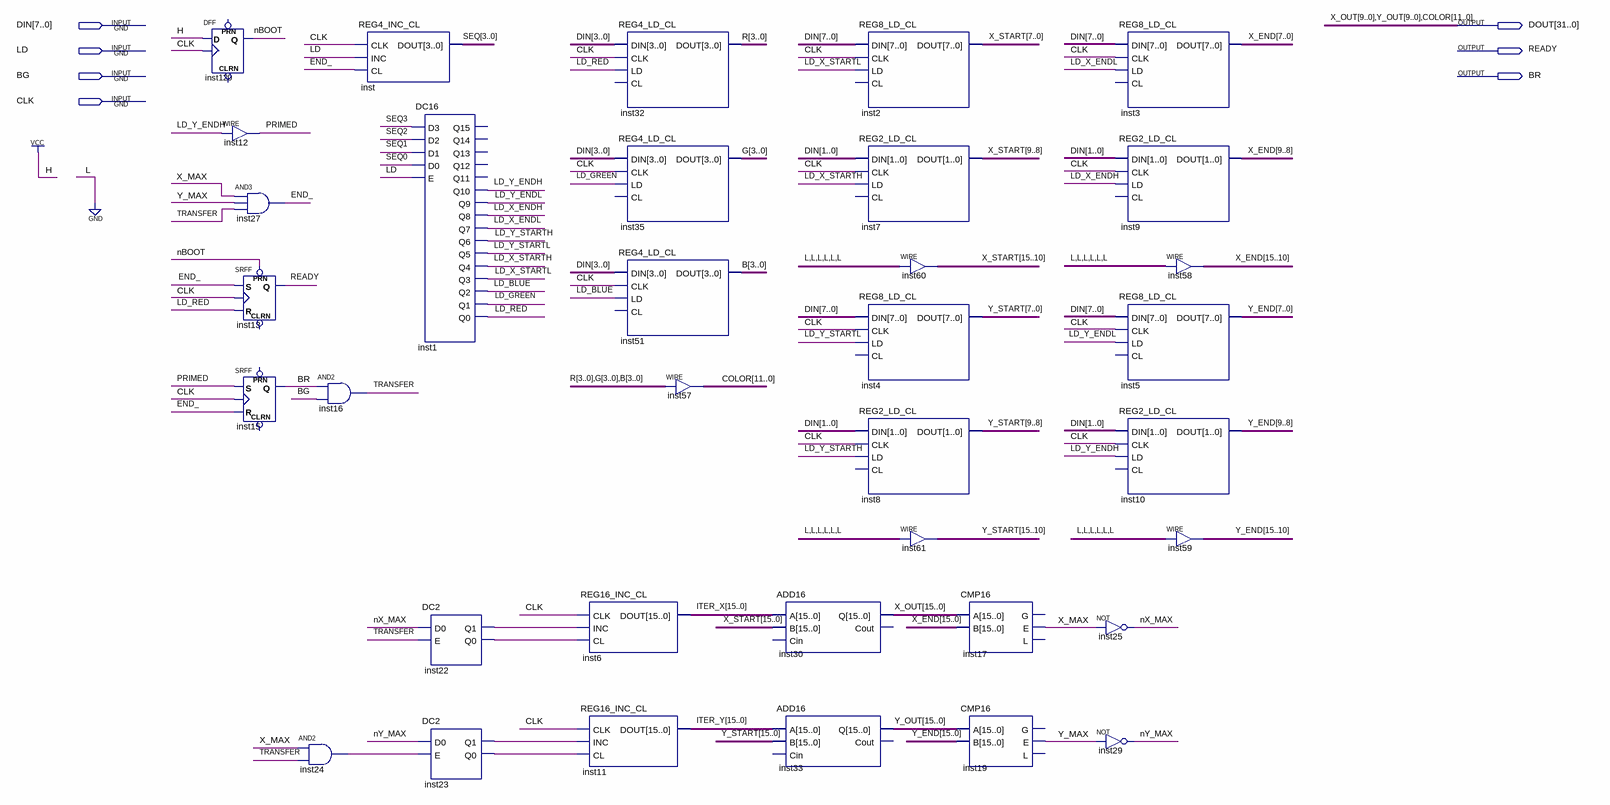
[diagram p0: schematic sheet]
// Quartus schematic render_rect.bdf as structural Verilog: 35 symbols, 7 pins
module render_rect (
  input  [7:0] DIN,
  input  LD,
  input  BG,
  input  CLK,
  output [31:0] DOUT,
  output READY,
  output BR
);

  wire END_, inst22_q0, inst22_q1, inst23_q0, inst23_q1, inst24_out, LD_BLUE, LD_GREEN, LD_RED, LD_X_ENDH,
       LD_X_ENDL, LD_X_STARTH, LD_X_STARTL, LD_Y_ENDH, LD_Y_ENDL, LD_Y_STARTH, LD_Y_STARTL, nBOOT, nX_MAX,
       nY_MAX, PRIMED, TRANSFER, X_MAX, Y_MAX;
  wire [3:0] B, G, R, SEQ;
  wire [15:0] ITER_X, ITER_Y, X_END, X_START, Y_END, Y_START;
  wire [15:10] X_OUT, Y_OUT;

  DFF inst120 (.CLK(CLK), .D(1'b1), .Q(nBOOT));  // open: CLRN, PRN
  assign PRIMED = LD_Y_ENDH;  // WIRE inst12
  and inst27 (END_, X_MAX, Y_MAX, TRANSFER);
  SRFF inst13 (.PRN(nBOOT), .S(END_), .R(LD_RED), .CLK(CLK), .Q(READY));  // open: CLRN
  SRFF inst15 (.S(PRIMED), .R(END_), .CLK(CLK), .Q(BR));  // open: PRN, CLRN
  and inst16 (TRANSFER, BR, BG);
  and inst24 (inst24_out, X_MAX, TRANSFER);
  REG4_INC_CL inst (.CLK(CLK), .INC(LD), .CL(END_), .DOUT(SEQ));
  DC16 inst1 (
    .D3(SEQ[3]), .D2(SEQ[2]), .D1(SEQ[1]), .D0(SEQ[0]), .E(LD), .Q10(LD_Y_ENDH), .Q9(LD_Y_ENDL),
    .Q8(LD_X_ENDH), .Q7(LD_X_ENDL), .Q6(LD_Y_STARTH), .Q5(LD_Y_STARTL), .Q4(LD_X_STARTH), .Q3(LD_X_STARTL),
    .Q2(LD_BLUE), .Q1(LD_GREEN), .Q0(LD_RED));  // open: Q15, Q14, Q13, Q12, Q11
  DC2 inst22 (.D0(nX_MAX), .E(TRANSFER), .Q1(inst22_q1), .Q0(inst22_q0));
  DC2 inst23 (.D0(nY_MAX), .E(inst24_out), .Q1(inst23_q1), .Q0(inst23_q0));
  REG16_INC_CL inst6 (.CLK(CLK), .INC(inst22_q1), .CL(inst22_q0), .DOUT(ITER_X));
  REG16_INC_CL inst11 (.CLK(CLK), .INC(inst23_q1), .CL(inst23_q0), .DOUT(ITER_Y));
  REG4_LD_CL inst32 (.DIN(DIN[3:0]), .CLK(CLK), .LD(LD_RED), .DOUT(R));  // open: CL
  REG4_LD_CL inst35 (.DIN(DIN[3:0]), .CLK(CLK), .LD(LD_GREEN), .DOUT(G));  // open: CL
  REG4_LD_CL inst51 (.DIN(DIN[3:0]), .CLK(CLK), .LD(LD_BLUE), .DOUT(B));  // open: CL
  assign DOUT[11:0] = {R, G, B};  // WIRE inst57
  ADD16 inst30 (.A(ITER_X), .B(X_START), .Q({X_OUT, DOUT[31:22]}));  // open: Cin, Cout
  ADD16 inst33 (.A(ITER_Y), .B(Y_START), .Q({Y_OUT, DOUT[21:12]}));  // open: Cin, Cout
  REG8_LD_CL inst2 (.DIN(DIN), .CLK(CLK), .LD(LD_X_STARTL), .DOUT(X_START[7:0]));  // open: CL
  REG2_LD_CL inst7 (.DIN(DIN[1:0]), .CLK(CLK), .LD(LD_X_STARTH), .DOUT(X_START[9:8]));  // open: CL
  assign X_START[15:10] = {6{1'b0}};  // WIRE inst60
  REG8_LD_CL inst4 (.DIN(DIN), .CLK(CLK), .LD(LD_Y_STARTL), .DOUT(Y_START[7:0]));  // open: CL
  REG2_LD_CL inst8 (.DIN(DIN[1:0]), .CLK(CLK), .LD(LD_Y_STARTH), .DOUT(Y_START[9:8]));  // open: CL
  assign Y_START[15:10] = {6{1'b0}};  // WIRE inst61
  CMP16 inst17 (.A({X_OUT, DOUT[31:22]}), .B(X_END), .E(X_MAX));  // open: G, L
  CMP16 inst19 (.A({Y_OUT, DOUT[21:12]}), .B(Y_END), .E(Y_MAX));  // open: G, L
  not inst25 (nX_MAX, X_MAX);
  not inst29 (nY_MAX, Y_MAX);
  REG8_LD_CL inst3 (.DIN(DIN), .CLK(CLK), .LD(LD_X_ENDL), .DOUT(X_END[7:0]));  // open: CL
  REG2_LD_CL inst9 (.DIN(DIN[1:0]), .CLK(CLK), .LD(LD_X_ENDH), .DOUT(X_END[9:8]));  // open: CL
  REG8_LD_CL inst5 (.DIN(DIN), .CLK(CLK), .LD(LD_Y_ENDL), .DOUT(Y_END[7:0]));  // open: CL
  REG2_LD_CL inst10 (.DIN(DIN[1:0]), .CLK(CLK), .LD(LD_Y_ENDH), .DOUT(Y_END[9:8]));  // open: CL
  assign X_END[15:10] = {6{1'b0}};  // WIRE inst58
  assign Y_END[15:10] = {6{1'b0}};  // WIRE inst59

  // Other names for the same wires on the sheet: COLOR[11:0] = DOUT[11:0]; X_OUT[9:0] = DOUT[31:22];
  //   Y_OUT[9:0] = DOUT[21:12]
endmodule
